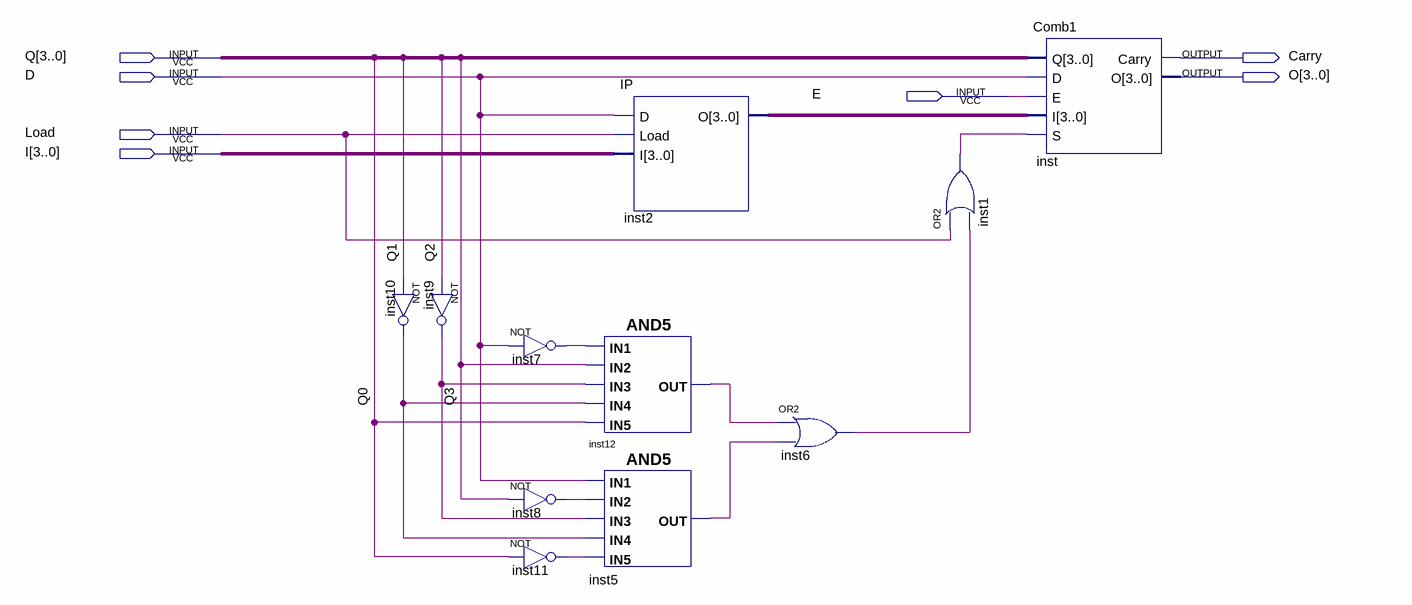
[diagram p0: schematic sheet]
// Quartus schematic Comb.bdf as structural Verilog: 11 symbols, 7 pins
module Comb (
  input  [3:0] Q,
  input  D,
  input  E,
  input  Load,
  input  [3:0] I,
  output Carry,
  output [3:0] O
);

  wire inst1_out, inst5_out, inst6_out, inst7_out, inst8_out, inst9_out, inst10_out, inst11_out, inst12_out;
  wire [3:0] inst2_o;

  not inst9 (inst9_out, Q[2]);
  not inst10 (inst10_out, Q[1]);
  not inst7 (inst7_out, D);
  not inst8 (inst8_out, Q[3]);
  not inst11 (inst11_out, Q[0]);
  IP inst2 (.D(D), .Load(Load), .I(I), .O(inst2_o));
  and inst12 (inst12_out, inst7_out, Q[3], inst9_out, inst10_out, Q[0]);
  and inst5 (inst5_out, D, inst8_out, inst9_out, inst10_out, inst11_out);
  or inst6 (inst6_out, inst12_out, inst5_out);
  or inst1 (inst1_out, Load, inst6_out);
  Comb1 inst (.Q(Q), .D(D), .E(E), .I(inst2_o), .S(inst1_out), .Carry(Carry), .O(O));
endmodule
